# Altium schematic sheet TopLevel.SchDoc
size A4
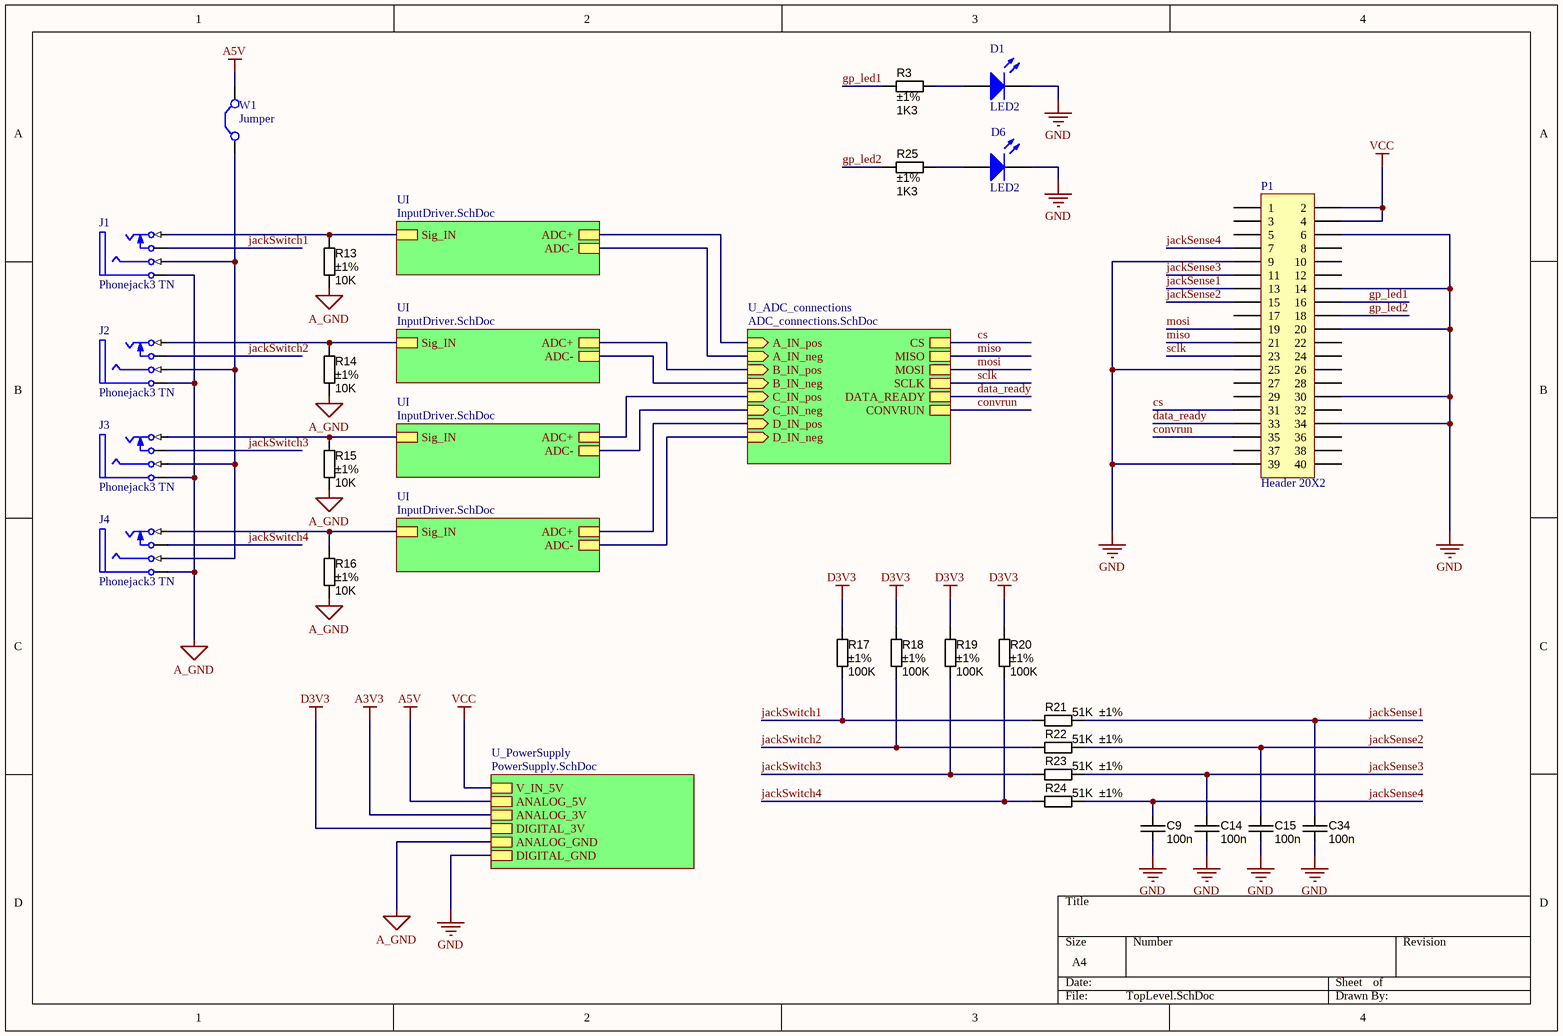
[diagram p0: TopLevel.SchDoc]

## Parts
C9  value 100n  [CAPC2012X135N]  (hidden comment: approved sub OK)
C14  value 100n  [CAPC2012X135N]  (hidden comment: approved sub OK)
C15  value 100n  [CAPC2012X135N]  (hidden comment: approved sub OK)
C34  value 100n  [CAPC2012X135N]  (hidden comment: approved sub OK)
D1  LED2  [3.2X1.6X1.1]
D6  LED2  [3.2X1.6X1.1]
J1  Phonejack3 TN  [SJ1-352XN Female Jack]
J2  Phonejack3 TN  [SJ1-352XN Female Jack]
J3  Phonejack3 TN  [SJ1-352XN Female Jack]
J4  Phonejack3 TN  [SJ1-352XN Female Jack]
P1  Header 20X2  [HDR2X20]
R3  value 1K3  Tolerance: ±1%  [RESC2012X70N]  (hidden comment: Thick Film)
R13  value 10K  Tolerance: ±1%  [RESC2012X70N]  (hidden comment: Thick Film)
R14  value 10K  Tolerance: ±1%  [RESC2012X70N]  (hidden comment: Thick Film)
R15  value 10K  Tolerance: ±1%  [RESC2012X70N]  (hidden comment: Thick Film)
R16  value 10K  Tolerance: ±1%  [RESC2012X70N]  (hidden comment: Thick Film)
R17  value 100K  Tolerance: ±1%  [RESC2012X70N]  (hidden comment: Thick Film)
R18  value 100K  Tolerance: ±1%  [RESC2012X70N]  (hidden comment: Thick Film)
R19  value 100K  Tolerance: ±1%  [RESC2012X70N]  (hidden comment: Thick Film)
R20  value 100K  Tolerance: ±1%  [RESC2012X70N]  (hidden comment: Thick Film)
R21  value 51K  Tolerance: ±1%  [RESC2012X70N]  (hidden comment: Thick Film)
R22  value 51K  Tolerance: ±1%  [RESC2012X70N]  (hidden comment: Thick Film)
R23  value 51K  Tolerance: ±1%  [RESC2012X70N]  (hidden comment: Thick Film)
R24  value 51K  Tolerance: ±1%  [RESC2012X70N]  (hidden comment: Thick Film)
R25  value 1K3  Tolerance: ±1%  [RESC2012X70N]  (hidden comment: Thick Film)
W1  Jumper  [HDR1X2]

## Sub-sheets
U_ADC_connections = ADC_connections.SchDoc: A_IN_pos (in), A_IN_neg (in), B_IN_pos (in), B_IN_neg (in), C_IN_pos (in), C_IN_neg (in), D_IN_pos (in), D_IN_neg (in), CS, MISO, MOSI, SCLK, DATA_READY, CONVRUN
U_PowerSupply = PowerSupply.SchDoc: V_IN_5V, ANALOG_5V, ANALOG_3V, DIGITAL_3V, ANALOG_GND, DIGITAL_GND
UI = InputDriver.SchDoc: Sig_IN, ADC+, ADC-
UI = InputDriver.SchDoc: Sig_IN, ADC+, ADC-
UI = InputDriver.SchDoc: Sig_IN, ADC+, ADC-
UI = InputDriver.SchDoc: Sig_IN, ADC+, ADC-

## Nets
A3V3: sheet U_PowerSupply/ANALOG_3V
A5V: W1.2(C2) ; sheet U_PowerSupply/ANALOG_5V
A_GND: J1.5(S) J2.5(S) J3.5(S) J4.5(S) R13.2 R14.2 R15.2 R16.2 ; sheet U_PowerSupply/ANALOG_GND
D3V3: R17.1 R18.1 R19.1 R20.1 ; sheet U_PowerSupply/DIGITAL_3V
GND: C9.2 C14.2 C15.2 C34.2 D1.2(K) D6.2(K) P1.6 P1.9 P1.14 P1.20 P1.25 P1.30 P1.34 P1.39 ; sheet U_PowerSupply/DIGITAL_GND
VCC: P1.2 P1.4 ; sheet U_PowerSupply/V_IN_5V
convrun: P1.35 ; sheet U_ADC_connections/CONVRUN
cs: P1.31 ; sheet U_ADC_connections/CS
data_ready: P1.33 ; sheet U_ADC_connections/DATA_READY
gp_led1: P1.16 R3.1
gp_led2: P1.18 R25.1
jackSense1: C34.1 P1.13 R21.1
jackSense2: C15.1 P1.15 R22.1
jackSense3: C14.1 P1.11 R23.1
jackSense4: C9.1 P1.7 R24.1
jackSwitch1: J1.2(TN) R17.2 R21.2
jackSwitch2: J2.2(TN) R18.2 R22.2
jackSwitch3: J3.2(TN) R19.2 R23.2
jackSwitch4: J4.2(TN) R20.2 R24.2
miso: P1.21 ; sheet U_ADC_connections/MISO
mosi: P1.19 ; sheet U_ADC_connections/MOSI
sclk: P1.23 ; sheet U_ADC_connections/SCLK
NetD1_1: D1.1(A) R3.2
NetD6_1: D6.1(A) R25.2
NetJ1_1: J1.1(T) R13.1 ; sheet UI/Sig_IN
NetJ1_3: J1.3(R) J2.3(R) J3.3(R) J4.3(R) W1.1(C1)
NetJ2_1: J2.1(T) R14.1 ; sheet UI/Sig_IN
NetJ3_1: J3.1(T) R15.1 ; sheet UI/Sig_IN
NetJ4_1: J4.1(T) R16.1 ; sheet UI/Sig_IN
(unnamed): sheet U_ADC_connections/A_IN_pos, sheet UI/ADC+
(unnamed): sheet U_ADC_connections/A_IN_neg, sheet UI/ADC-
(unnamed): sheet U_ADC_connections/B_IN_pos, sheet UI/ADC+
(unnamed): sheet U_ADC_connections/B_IN_neg, sheet UI/ADC-
(unnamed): sheet U_ADC_connections/C_IN_pos, sheet UI/ADC+
(unnamed): sheet U_ADC_connections/C_IN_neg, sheet UI/ADC-
(unnamed): sheet U_ADC_connections/D_IN_pos, sheet UI/ADC+
(unnamed): sheet U_ADC_connections/D_IN_neg, sheet UI/ADC-

Not connected (* = marked no-connect by the designer): P1 1 3 5 8 10 12 17 22 24 26 27 28 29 32 36 37 38 40

## Library data of the parts
C9 C14 C15 C34 = CAPC_100n_0805_X7R_100V_10%: Capacitor SMD Cer 100nF 10% 100V X7R 0805; Manufacturer 1: TDK Corporation; Manufacturer Part Number 1: C2012X7R2A104K; Ratings: 100V; X7R; Material: ceramic; SCDType: undef; Package / Case: 0805; Tolerance: ±10%; Supplier 1: Digi-Key; Supplier Part Number 1: 445-1418-1-ND
D1 D6 = LED2: Typical RED, GREEN, YELLOW, AMBER GaAs LED; Published: 8-Jun-2000; LatestRevisionDate: 17-Jul-2002; LatestRevisionNote: Re-released for DXP Platform.; PackageVersion: Feb-2002; PackageReference: 3.2X1.6X1.1; Publisher: Altium Limited; PackageDescription: SM LED; 2 Flat Leads
J1-J4 = Phonejack3 TN: Jack Socket, 1/4" [6.5mm], Thru-Hole, Vertical, 3-Conductor with Tip closed & Ring open; pin to pad: 1>2 2>10 5>1; PackageDocument: 2003; PCB_Layout: Complies with manufacturer's recommendation.; DrillAndSlotSize: Corresponds to nominal value.; Published: 15-Jul-2004; DatasheetDocument: 2003; PackageReference: S1VS_SSB; Publisher: Altium Limited; ComponentLink1Description: Manufacturer Link; ComponentLink1URL: http://www.cliffuk.co.uk/
P1 = Header 20X2: Header, 20-Pin, Dual row; LatestRevisionDate: 17-Jul-2002; LatestRevisionNote: Re-released for DXP Platform.; Publisher: Altium Limited
R3 R25 = RES_1K3_0805_1%: Resistor SMD chip 1.3k Ohm 0.125W 1% 0805; Manufacturer 1: Vishay/Dale; Manufacturer Part Number 1: CRCW08051K30FKEA; Ratings: 1/8W; SCDType: spec; Package / Case: 0805 (2012 metric); Supplier 1: Digi-Key; Supplier Part Number 1: 541-1.30KCCT-ND
R13-R16 = RES_10K_0805_1%: Resistor SMD chip 10k Ohm 0.125W 1% 0805; Manufacturer 1: Vishay/Dale; Manufacturer Part Number 1: CRCW080510K0FKEA; Ratings: 1/8W; SCDType: spec; Package / Case: 0805 (2012 metric); Supplier 1: Digi-Key; Supplier Part Number 1: 541-10.0KCCT-ND; Material: Thick Film
R17-R20 = RES_100K_0805_1%: Resistor SMD chip 100k Ohm 0.125W 1% 0805; Manufacturer 1: Vishay/Dale; Manufacturer Part Number 1: CRCW0805100KFKEA; Ratings: 1/8W; SCDType: spec; Package / Case: 0805 (2012 metric); Supplier 1: Digi-Key; Supplier Part Number 1: 541-100KCCT-ND
R21-R24 = RES_51K_0805_1%: Resistor SMD chip 51k Ohm 0.125W 1% 0805; Manufacturer 1: Yageo; Manufacturer Part Number 1: RC0805FR-0751KL; Ratings: 1/8W; SCDType: spec; Package / Case: 0805 (2012 Metric); Supplier 1: Digi-Key; Supplier Part Number 1: 311-51.0KCRCT-ND
W1 = Jumper: Jumper Wire; Published: 24-Mar-1999; LatestRevisionDate: 17-Jul-2002; LatestRevisionNote: Re-released for DXP Platform.; PackageReference: RAD-0.2; Publisher: Altium Limited; PackageDescription: Radial Cap, Thru-Hole; 2 Leads; 0.2 in Pin Spacing